# Altium schematic sheet Sigma_Delta.SCHDOC: Line Detector Module (Sigma_Delta)
size A4; ApprovedBy: zac1; Author: mmb1; DrawnBy: mmb1; Engineer: mmb1; Organization: Berne University of Applied Sciences; Address1: School of Engineering and; Address2: Information Technology; Address3: Quellgasse 21; Address4: CH-2501 Biel; Revision: 1.0; SheetNumber: 5; SheetTotal: 6
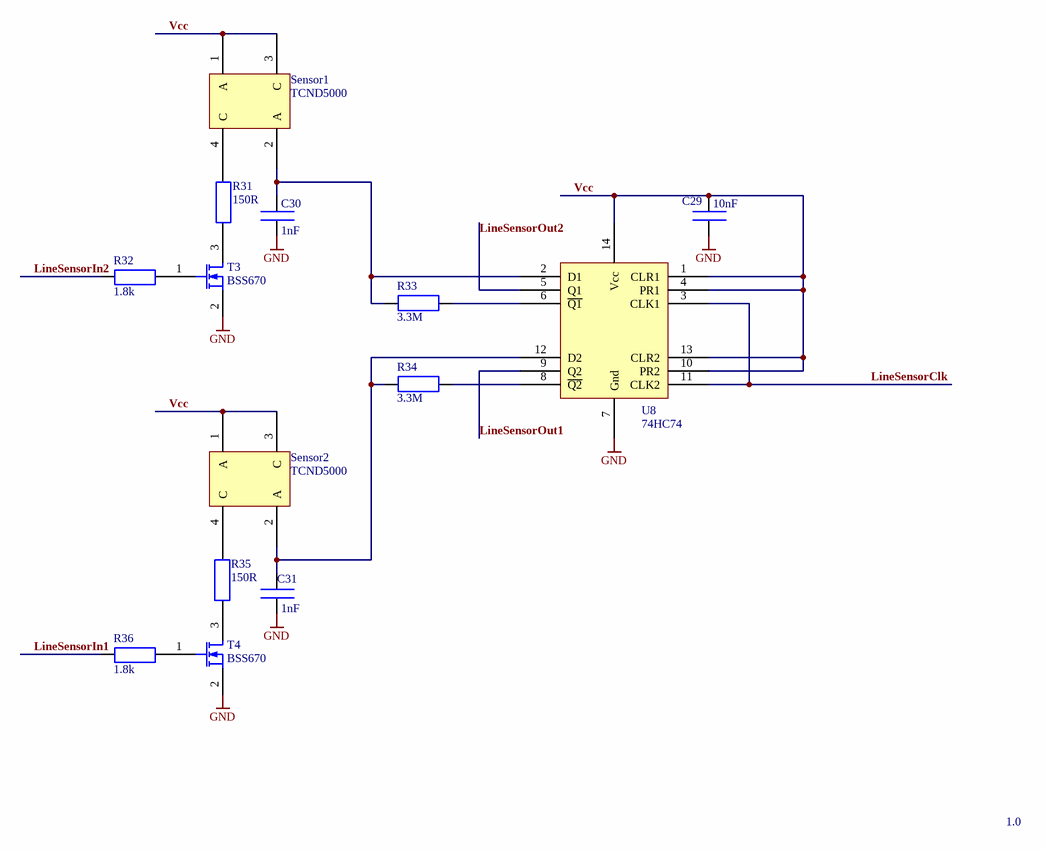
[diagram p0: Sigma_Delta.SCHDOC]

## Parts
C29  10nF  [1608[0603]]
C30  1nF  [1608[0603]]
C31  1nF  [1608[0603]]
R31  150R  [1608[0603]]
R32  1.8k  [1608[0603]]
R33  3.3M  [1608[0603]]
R34  3.3M  [1608[0603]]
R35  150R  [1608[0603]]
R36  1.8k  [1608[0603]]
Sensor1  TCND5000  [TCND5000]
Sensor2  TCND5000  [TCND5000]
T3  BSS670  [SOT-23]
T4  BSS670  [SOT-23]
U8  74HC74  [SO-G14]

## Nets
GND: C29.1(J1) C30.1(J1) C31.1(J1) T3.2(S) T4.2(S) U8.7(Gnd)
LineSensorClk: U8.3(CLK1) U8.11(CLK2)
LineSensorIn1: R36.1(J1)
LineSensorIn2: R32.1(J1)
LineSensorOut1: U8.9(Q2)
LineSensorOut2: U8.5(Q1)
Vcc: C29.2(J2) Sensor1.1(A) Sensor1.3(C) Sensor2.1(A) Sensor2.3(C) U8.1(CLR1) U8.4(PR1) U8.10(PR2) U8.13(CLR2) U8.14(Vcc)
NetC30_2: C30.2(J2) R33.2(J2) Sensor1.2(A) U8.2(D1)
NetC31_2: C31.2(J2) R34.2(J2) Sensor2.2(A) U8.12(D2)
NetR31_1: R31.1(J1) T3.3(D)
NetR31_2: R31.2(J2) Sensor1.4(C)
NetR32_2: R32.2(J2) T3.1(G)
NetR33_1: R33.1(J1) U8.6(~{Q1})
NetR34_1: R34.1(J1) U8.8(~{Q2})
NetR35_1: R35.1(J1) Sensor2.4(C)
NetR35_2: R35.2(J2) T4.3(D)
NetR36_2: R36.2(J2) T4.1(G)

## Notes on the sheet
- 1.0
- Title:
- Size:
- Date:
- A4_L
- Author:
- Time:
- Revision:
- Sheet
- of
- File:

## Library data of the parts
C29 = CAP: Capacitor; Manufacturer: AVX; Part Number: 06035C103KAT2A; Value: 10nF 0603; Currency: CHF; Packaging unit: 10; Part Type: 10nF; Distributor: Farnell; Distributor Number: 1327 675; Price: 0.07; RoHS: yes
C30 C31 = CAP: Capacitor; Manufacturer: Murata; Part Number: GRM188R71H102KA01D; Value: 1nF 0603; Currency: CHF; Packaging unit: 10; Part Type: 1nF; Distributor: Farnell; Distributor Number: 8819 955; Price: 0.071; RoHS: yes
R31 R35 = RES: Resistance; Manufacturer: Multicomp; Part Number: MC 0.063W 0603 1% 150R; Value: 150R 0603; Currency: CHF; Packaging unit: 50; Part Type: 150R; Distributor: Farnell; Distributor Number: 9330 593; RoHS: X-yes; Price: 0.062
R32 R36 = RES: Resistance; Manufacturer: Multicomp; Part Number: MC 0.063W 0603 1% 1K8; Value: 1.8k 0603; Currency: CHF; Packaging unit: 50; Part Type: 1.8k; Distributor: Farnell; Distributor Number: 9330 712; Price: 0.062; RoHS: X-yes
R33 R34 = RES: Resistance; Manufacturer: PHYCOMP; Part Number: 232270463305; Value: 3.3M 0603; Currency: CHF; Packaging unit: 50; Part Type: 3.3M; Distributor: Farnell; Distributor Number: 9238 905; RoHS: yes; Price: 0.122
Sensor1 Sensor2 = TCND5000: Manufacturer: Vishay; Currency: CHF; lead time: 2 Weeks; Packaging unit: 1; Value: TCND5000; Distributor: Farnell; Distributor Number: 9169 997; Part Number: TCND5000; RoHS: yes; Price: 3.3
T3 T4 = MOSFET-N: Manufacturer: Infineon; Part Number: BSS670S2L; Currency: CHF; Packaging unit: 5; Value: BSS670; Distributor: Farnell; Distributor Number: 1095 673; Price: 0.35; RoHS: yes
U8 = 74HC74: Manufacturer: TI; Part Number: SN74HC74D; Value: 74HC74D; Currency: CHF; Packaging unit: 1; Distributor: Farnell; Distributor Number: 9591 680; RoHS: yes; Price: 0.632